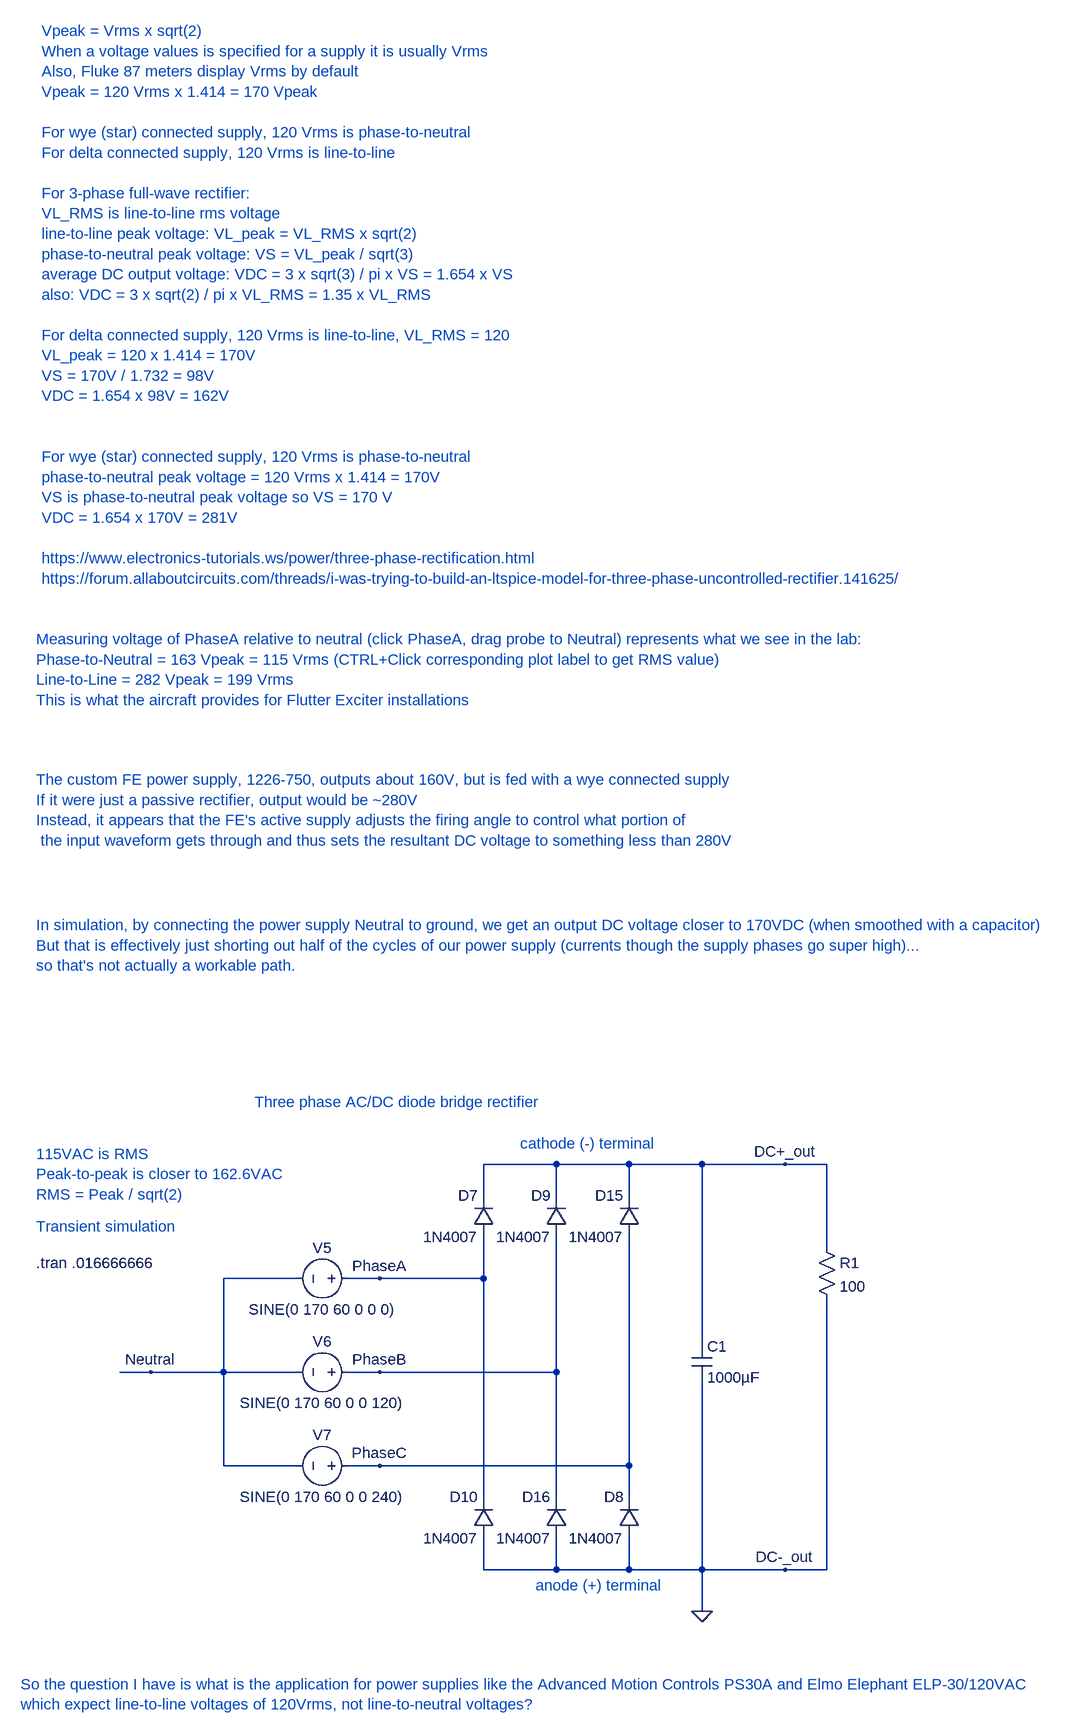
[diagram p0: schematic 2025-09-22 3-Phase Rectifier 4.asc]
2025-09-22 3-Phase Rectifier 4.asc, the LTspice schematic file:
Version 4.1
SHEET 1 3872 1920
WIRE 2368 752 2256 752
WIRE 2480 752 2368 752
WIRE 2592 752 2480 752
WIRE 2720 752 2592 752
WIRE 2784 752 2720 752
WIRE 2256 800 2256 752
WIRE 2368 800 2368 752
WIRE 2480 800 2480 752
WIRE 2784 880 2784 752
WIRE 1968 928 1856 928
WIRE 2096 928 2048 928
WIRE 2256 928 2256 864
WIRE 2256 928 2096 928
WIRE 2592 1024 2592 752
WIRE 1744 1072 1696 1072
WIRE 1856 1072 1856 928
WIRE 1856 1072 1744 1072
WIRE 1968 1072 1856 1072
WIRE 2096 1072 2048 1072
WIRE 2368 1072 2368 864
WIRE 2368 1072 2096 1072
WIRE 1856 1216 1856 1072
WIRE 1968 1216 1856 1216
WIRE 2096 1216 2048 1216
WIRE 2480 1216 2480 864
WIRE 2480 1216 2096 1216
WIRE 2256 1264 2256 928
WIRE 2368 1264 2368 1072
WIRE 2480 1264 2480 1216
WIRE 2256 1376 2256 1328
WIRE 2368 1376 2368 1328
WIRE 2368 1376 2256 1376
WIRE 2480 1376 2480 1328
WIRE 2480 1376 2368 1376
WIRE 2592 1376 2592 1088
WIRE 2592 1376 2480 1376
WIRE 2720 1376 2592 1376
WIRE 2784 1376 2784 960
WIRE 2784 1376 2720 1376
WIRE 2592 1440 2592 1376
FLAG 2720 752 DC+_out
FLAG 1744 1072 Neutral
FLAG 2096 928 PhaseA
FLAG 2096 1072 PhaseB
FLAG 2096 1216 PhaseC
FLAG 2592 1440 0
FLAG 2720 1376 DC-_out
SYMBOL voltage 2064 928 R90
WINDOW 0 -32 56 VBottom 2
WINDOW 3 32 56 VTop 2
WINDOW 123 0 0 Left 0
WINDOW 39 0 0 Left 0
SYMATTR InstName V5
SYMATTR Value SINE(0 170 60 0 0 0)
SYMBOL voltage 2064 1072 R90
WINDOW 0 -32 56 VBottom 2
WINDOW 3 32 56 VTop 2
WINDOW 123 0 0 Left 0
WINDOW 39 0 0 Left 0
SYMATTR InstName V6
SYMATTR Value SINE(0 170 60 0 0 120)
SYMBOL voltage 2064 1216 R90
WINDOW 0 -32 56 VBottom 2
WINDOW 3 32 56 VTop 2
WINDOW 123 0 0 Left 0
WINDOW 39 0 0 Left 0
SYMATTR InstName V7
SYMATTR Value SINE(0 170 60 0 0 240)
SYMBOL diode 2272 864 R180
WINDOW 0 24 64 Left 2
WINDOW 3 24 0 Left 2
SYMATTR InstName D7
SYMATTR Value 1N4007
SYMBOL diode 2496 1328 R180
WINDOW 0 24 64 Left 2
WINDOW 3 24 0 Left 2
SYMATTR InstName D8
SYMATTR Value 1N4007
SYMBOL diode 2384 864 R180
WINDOW 0 24 64 Left 2
WINDOW 3 24 0 Left 2
SYMATTR InstName D9
SYMATTR Value 1N4007
SYMBOL diode 2272 1328 R180
WINDOW 0 24 64 Left 2
WINDOW 3 24 0 Left 2
SYMATTR InstName D10
SYMATTR Value 1N4007
SYMBOL diode 2496 864 R180
WINDOW 0 24 64 Left 2
WINDOW 3 24 0 Left 2
SYMATTR InstName D15
SYMATTR Value 1N4007
SYMBOL diode 2384 1328 R180
WINDOW 0 24 64 Left 2
WINDOW 3 24 0 Left 2
SYMATTR InstName D16
SYMATTR Value 1N4007
SYMBOL cap 2576 1024 R0
SYMATTR InstName C1
SYMATTR Value 1000µF
SYMBOL res 2768 864 R0
SYMATTR InstName R1
SYMATTR Value 100
TEXT 1568 904 Left 2 !.tran .016666666
TEXT 1904 656 Left 2 ;Three phase AC/DC diode bridge rectifier
TEXT 1568 848 Left 2 ;Transient simulation
TEXT 1568 736 Left 2 ;115VAC is RMS\nPeak-to-peak is closer to 162.6VAC\nRMS = Peak / sqrt(2)
TEXT 1568 -56 Left 2 ;Measuring voltage of PhaseA relative to neutral (click PhaseA, drag probe to Neutral) represents what we see in the lab:\nPhase-to-Neutral = 163 Vpeak = 115 Vrms (CTRL+Click corresponding plot label to get RMS value)\nLine-to-Line = 282 Vpeak = 199 Vrms\nThis is what the aircraft provides for Flutter Exciter installations
TEXT 1568 384 Left 2 ;In simulation, by connecting the power supply Neutral to ground, we get an output DC voltage closer to 170VDC (when smoothed with a capacitor)\nBut that is effectively just shorting out half of the cycles of our power supply (currents though the supply phases go super high)...\nso that's not actually a workable path.
TEXT 2336 1400 Left 2 ;anode (+) terminal
TEXT 2312 720 Left 2 ;cathode (-) terminal
TEXT 1576 -992 Left 2 ;Vpeak = Vrms x sqrt(2)\nWhen a voltage values is specified for a supply it is usually Vrms \nAlso, Fluke 87 meters display Vrms by default\nVpeak = 120 Vrms x 1.414 = 170 Vpeak\n \nFor wye (star) connected supply, 120 Vrms is phase-to-neutral\nFor delta connected supply, 120 Vrms is line-to-line\n \nFor 3-phase full-wave rectifier: \nVL_RMS is line-to-line rms voltage\nline-to-line peak voltage: VL_peak = VL_RMS x sqrt(2)\nphase-to-neutral peak voltage: VS = VL_peak / sqrt(3)\naverage DC output voltage: VDC = 3 x sqrt(3) / pi x VS = 1.654 x VS\nalso: VDC = 3 x sqrt(2) / pi x VL_RMS = 1.35 x VL_RMS \n \nFor delta connected supply, 120 Vrms is line-to-line, VL_RMS = 120\nVL_peak = 120 x 1.414 = 170V\nVS = 170V / 1.732 = 98V\nVDC = 1.654 x 98V = 162V\n \n \nFor wye (star) connected supply, 120 Vrms is phase-to-neutral\nphase-to-neutral peak voltage = 120 Vrms x 1.414 = 170V\nVS is phase-to-neutral peak voltage so VS = 170 V\nVDC = 1.654 x 170V = 281V\n \nhttps://www.electronics-tutorials.ws/power/three-phase-rectification.html\nhttps://forum.allaboutcircuits.com/threads/i-was-trying-to-build-an-ltspice-model-for-three-phase-uncontrolled-rectifier.141625/
TEXT 1568 160 Left 2 ;The custom FE power supply, 1226-750, outputs about 160V, but is fed with a wye connected supply\nIf it were just a passive rectifier, output would be ~280V\nInstead, it appears that the FE's active supply adjusts the firing angle to control what portion of\n the input waveform gets through and thus sets the resultant DC voltage to something less than 280V
TEXT 1544 1552 Left 2 ;So the question I have is what is the application for power supplies like the Advanced Motion Controls PS30A and Elmo Elephant ELP-30/120VAC\nwhich expect line-to-line voltages of 120Vrms, not line-to-neutral voltages?

The netlist it stands for:
* 2025-09-22 3-Phase Rectifier 4.asc
V5 PhaseA Neutral SINE(0 170 60 0 0 0)
V6 PhaseB Neutral SINE(0 170 60 0 0 120)
V7 PhaseC Neutral SINE(0 170 60 0 0 240)
D7 PhaseA DC+_out 1N4007
D8 0 PhaseC 1N4007
D9 PhaseB DC+_out 1N4007
D10 0 PhaseA 1N4007
D15 PhaseC DC+_out 1N4007
D16 0 PhaseB 1N4007
C1 DC+_out 0 1000µF
R1 DC+_out 0 100
.model D D
.lib standard.dio
.tran .016666666
* Three phase AC/DC diode bridge rectifier
* Transient simulation
* 115VAC is RMS
* Peak-to-peak is closer to 162.6VAC
* RMS = Peak / sqrt(2)
* Measuring voltage of PhaseA relative to neutral (click PhaseA, drag probe to Neutral) represents what we see in the lab:
* Phase-to-Neutral = 163 Vpeak = 115 Vrms (CTRL+Click corresponding plot label to get RMS value)
* Line-to-Line = 282 Vpeak = 199 Vrms
* This is what the aircraft provides for Flutter Exciter installations
* In simulation, by connecting the power supply Neutral to ground, we get an output DC voltage closer to 170VDC (when smoothed with a capacitor)
* But that is effectively just shorting out half of the cycles of our power supply (currents though the supply phases go super high)...
* so that's not actually a workable path.
* anode (+) terminal
* cathode (-) terminal
* Vpeak = Vrms x sqrt(2)
* When a voltage values is specified for a supply it is usually Vrms
* Also, Fluke 87 meters display Vrms by default
* Vpeak = 120 Vrms x 1.414 = 170 Vpeak
* For wye (star) connected supply, 120 Vrms is phase-to-neutral
* For delta connected supply, 120 Vrms is line-to-line
* For 3-phase full-wave rectifier:
* VL_RMS is line-to-line rms voltage
* line-to-line peak voltage: VL_peak = VL_RMS x sqrt(2)
* phase-to-neutral peak voltage: VS = VL_peak / sqrt(3)
* average DC output voltage: VDC = 3 x sqrt(3) / pi x VS = 1.654 x VS
* also: VDC = 3 x sqrt(2) / pi x VL_RMS = 1.35 x VL_RMS
* For delta connected supply, 120 Vrms is line-to-line, VL_RMS = 120
* VL_peak = 120 x 1.414 = 170V
* VS = 170V / 1.732 = 98V
* VDC = 1.654 x 98V = 162V
* For wye (star) connected supply, 120 Vrms is phase-to-neutral
* phase-to-neutral peak voltage = 120 Vrms x 1.414 = 170V
* VS is phase-to-neutral peak voltage so VS = 170 V
* VDC = 1.654 x 170V = 281V
* https://www.electronics-tutorials.ws/power/three-phase-rectification.html
* https://forum.allaboutcircuits.com/threads/i-was-trying-to-build-an-ltspice-model-for-three-phase-uncontrolled-rectifier.141625/
* The custom FE power supply, 1226-750, outputs about 160V, but is fed with a wye connected supply
* If it were just a passive rectifier, output would be ~280V
* Instead, it appears that the FE's active supply adjusts the firing angle to control what portion of
*  the input waveform gets through and thus sets the resultant DC voltage to something less than 280V
* So the question I have is what is the application for power supplies like the Advanced Motion Controls PS30A and Elmo Elephant ELP-30/120VAC
* which expect line-to-line voltages of 120Vrms, not line-to-neutral voltages?
.backanno
.end